# EAGLE design TeensyCarrier (EAGLE 9.4.2)
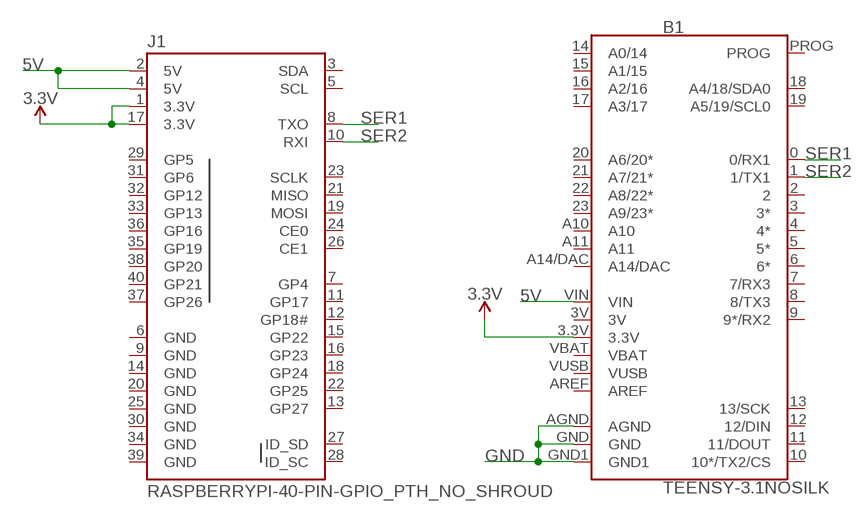
[diagram p0: schematic, sheet 1]

## Parts
B1  TEENSY-3.1NOSILK  [TEENSY-3.1_NOSILK]
J1  RASPBERRYPI-40-PIN-GPIO_PTH_NO_SHROUD  [2X20]

## Nets
3.3V: B1.3.3V J1.1(3.3V) J1.17(3.3V)
5V: B1.VIN J1.2(5V) J1.4(5V)
GND: B1.AGND B1.GND B1.GND1
SER1: B1.0(0/RX1) J1.8(TXO)
SER2: B1.1(1/TX1) J1.10(RXI)
Unconnected: B1.2 B1.3(3*) B1.4(4*) B1.5(5*) B1.6(6*) B1.7(7/RX3) B1.8(8/TX3) B1.9(9*/RX2) B1.10(10*/TX2/CS) B1.11(11/DOUT) B1.12(12/DIN) B1.13(13/SCK) B1.14(A0/14) B1.15(A1/15) B1.16(A2/16) B1.17(A3/17) B1.18(A4/18/SDA0) B1.19(A5/19/SCL0) B1.20(A6/20*) B1.21(A7/21*) B1.22(A8/22*) B1.23(A9/23*) B1.A10 B1.A11 B1.A14/DAC B1.AREF B1.PROG J1.3(SDA) J1.5(SCL) J1.7(GP4) J1.11(GP17) J1.12(GP18#) J1.13(GP27) J1.15(GP22) J1.16(GP23) J1.18(GP24) J1.19(MOSI) J1.21(MISO) J1.22(GP25) J1.23(SCLK) J1.24(CE0) J1.26(CE1) J1.27(ID_SD) J1.28(ID_SC) J1.29(GP5) J1.31(GP6) J1.32(GP12) J1.33(GP13) J1.35(GP19) J1.36(GP16) J1.37(GP26) J1.38(GP20) J1.40(GP21)

## Power pins joined to a net without a drawn wire
3V: B1.3V
GND: J1.6(GND) J1.9(GND) J1.14(GND) J1.20(GND) J1.25(GND) J1.30(GND) J1.34(GND) J1.39(GND)
VBAT: B1.VBAT
VUSB: B1.VUSB

## Library data of the parts
B1 = SparkFun-Boards:TEENSY-3.1: Teensy 3+ Footprint Mechanical footprint with connectors for Teensy Development Board with ARM Cortex. SparkFun Products: Teensy 3.2 <https://www.sparkfun.com/products/13736> Teensy LC <https://www.sparkfun.com/products/13305>; SF_ID: DEV-12646
J1 = SparkFun-Connectors:RASPBERRYPI-40-PIN-GPIO: Raspberry Pi GPIO Header 2x20 pin connector, as found on B, B+, A+ models. Both shrouded PTH and SMT versions available. SparkFun Products: GPIO Shrouded Header <https://www.sparkfun.com/products/13054>- PTH SparkFun Pi Wedge (Preassembled) <https://www.sparkfun.com/products/13717>

## Board
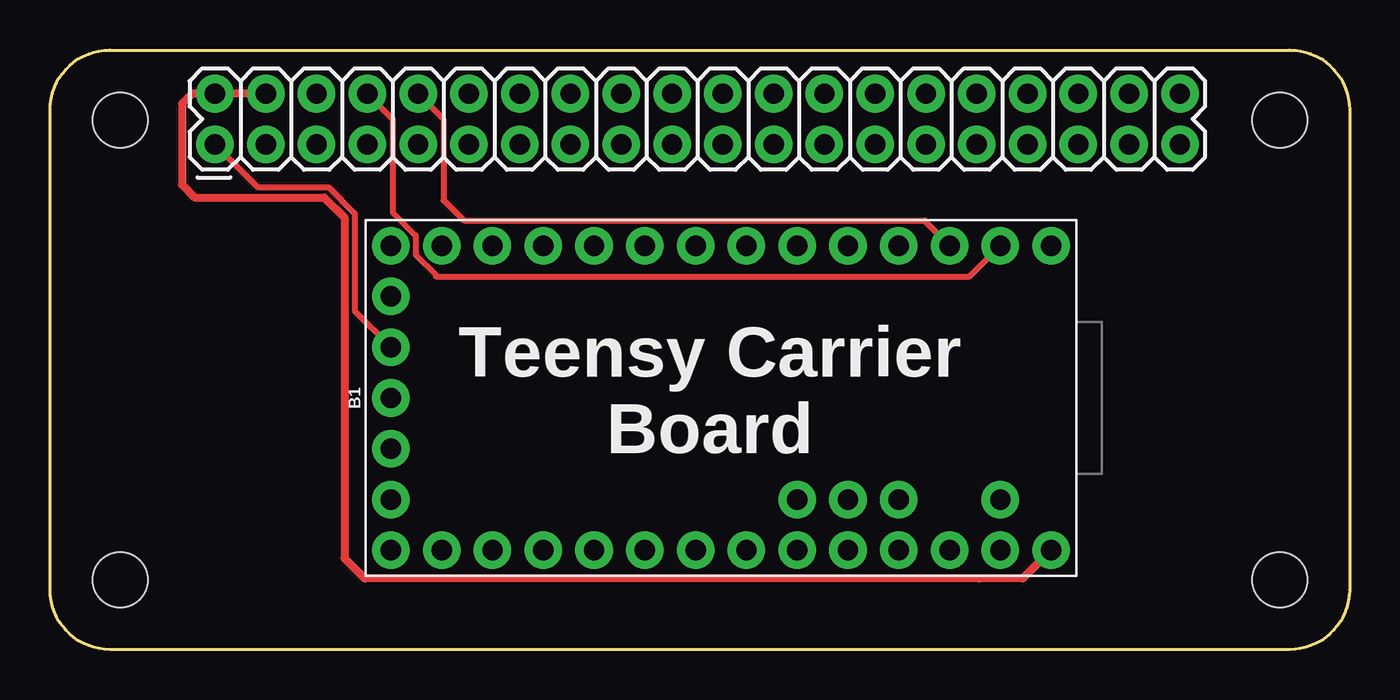
[diagram p1: board, top side]
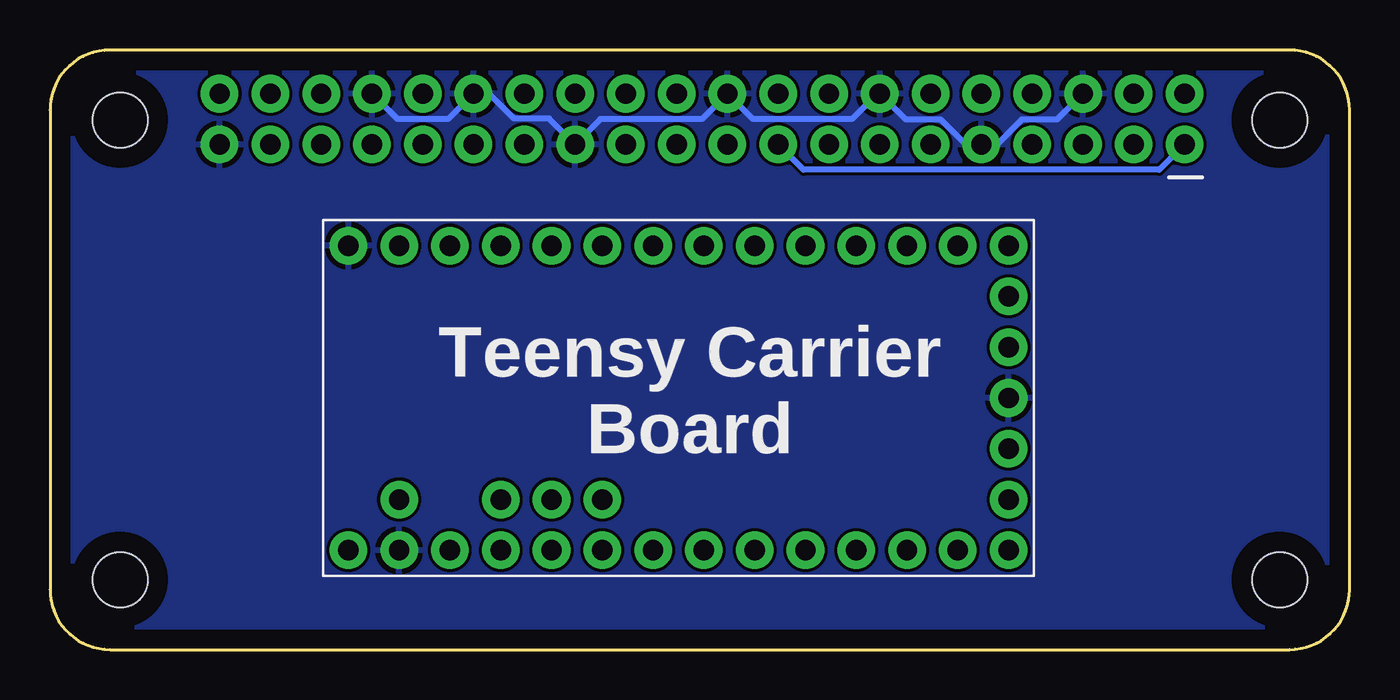
[diagram p2: board, bottom side, seen from below]

Size 65 x 30 mm. Coordinates in mm from the lower left corner, seen from the top.
Outline: 0,27 0,3 arc90 3,0 62,0 arc90 65,3 65,27 arc90 62,30 3,30 arc90 0,27
Copper layers (1*16): Top 0.035mm / dielectric 1.5mm / Bottom 0.035mm
Design rules "default": minimum track width 6mil, minimum drill 0.35mm, track to track 6mil, track to pad 6mil, pad to pad 6mil, via to via 6mil, smd to smd 6mil, copper to edge 40mil, drill to drill 6mil, minimum pad ring 10mil, minimum via ring 8mil, stop-mask expansion 4mil, vias tented up to drill 0mil, thermal gap 10mil
Holes 2.75 mm at 3.5,3.5 3.5,26.5 61.5,3.5 61.5,26.5
Milling: 8 lines

### Footprints (pad centres in the part's own frame; a part is rotated, then mirrored left to right if it is on the bottom)
TEENSY-3.1_NOSILK = drill 1.016 pad 1.88: 0 7.62,-13.97; 1 7.62,-11.43; 2 7.62,-8.89; 3 7.62,-6.35; 3.3V 2.54,16.51; 3V -7.62,-11.43; 4 7.62,-3.81; 5 7.62,-1.27; 6 7.62,1.27; 7 7.62,3.81; 8 7.62,6.35; 9 7.62,8.89; 10 7.62,11.43; 11 7.62,13.97; 12 7.62,16.51; 13 -7.62,16.51; 14 -7.62,13.97; 15 -7.62,11.43; 16 -7.62,8.89; 17 -7.62,6.35; 18 -7.62,3.81; 19 -7.62,1.27; 20 -7.62,-1.27; 21 -7.62,-3.81; 22 -7.62,-6.35; 23 -7.62,-8.89; A10 -5.08,-6.35; A11 -5.08,-3.81; A14/DAC -5.08,16.51; AGND -7.62,-13.97; AREF -5.08,-8.89; GND 0,16.51; GND1 7.62,-16.51; PROG -2.54,16.51; VBAT 5.08,16.51; VIN -7.62,-16.51; VUSB -5.08,-13.97
2X20 = drill 1.016 pad 1.88: 1 0,0; 2 0,2.54; 3 2.54,0; 4 2.54,2.54; 5 5.08,0; 6 5.08,2.54; 7 7.62,0; 8 7.62,2.54; 9 10.16,0; 10 10.16,2.54; 11 12.7,0; 12 12.7,2.54; 13 15.24,0; 14 15.24,2.54; 15 17.78,0; 16 17.78,2.54; 17 20.32,0; 18 20.32,2.54; 19 22.86,0; 20 22.86,2.54; 21 25.4,0; 22 25.4,2.54; 23 27.94,0; 24 27.94,2.54; 25 30.48,0; 26 30.48,2.54; 27 33.02,0; 28 33.02,2.54; 29 35.56,0; 30 35.56,2.54; 31 38.1,0; 32 38.1,2.54; 33 40.64,0; 34 40.64,2.54; 35 43.18,0; 36 43.18,2.54; 37 45.72,0; 38 45.72,2.54; 39 48.26,0; 40 48.26,2.54

### Placement (x,y rotation side)
B1  33.56,12.59 90 top
J1  8.26,25.27 0 top

### Tracks (layer width: path | path; a pad name or v marks a point on that pad's centre or on a via)
3.3V
  Top 0.305: J1.1 10.4,23.13 13.93,23.13 15.24,21.82 15.24,16.94 B1.3.3V
  Bottom 0.305: J1.17 27.3,24 9.53,24 J1.1
5V
  Top 0.406: B1.VIN 48.66,3.56 46.48,3.56 15.75,3.56 14.73,4.57 14.73,21.61 13.72,22.62 7.24,22.62 6.6,23.26 6.6,27.3 7.11,27.81 J1.2 J1.4
GND
  Bottom 0.305: J1.6 14.63,26.52 16.39,26.52 17.64,25.27 J1.9 19.2,25.27 20.44,26.52 22.2,26.52 J1.14 23.62,27.81 24.89,26.54 29.84,26.54 J1.20 32.38,26.54 37.47,26.54 J1.25 40.03,26.57 41.79,26.57 43.03,27.81 J1.30 45.09,26.54 47.62,26.54 J1.34
  pour Bottom: 2.67,29.97 62.1,29.97 arc-90 65.02,27.05 65.02,25.91 65.02,3.17 arc-90 61.85,0 2.92,0 arc-90 0,2.92 0,27.43 arc-90 2.54,29.97
SER1
  Top 0.305: B1.0 45.99,18.67 19.3,18.67 19.3,18.74 18.3,19.74 18.3,20.72 17.14,21.88 17.14,26.54 J1.8
SER2
  Top 0.305: J1.10 19.68,26.54 19.68,22.48 20.7,21.46 43.74,21.46 B1.1

### Text on the board
tPlace: Teensy Carrier / Board
bPlace: Teensy Carrier / Board